# Altium schematic sheet MQ-X.SchDoc
size A
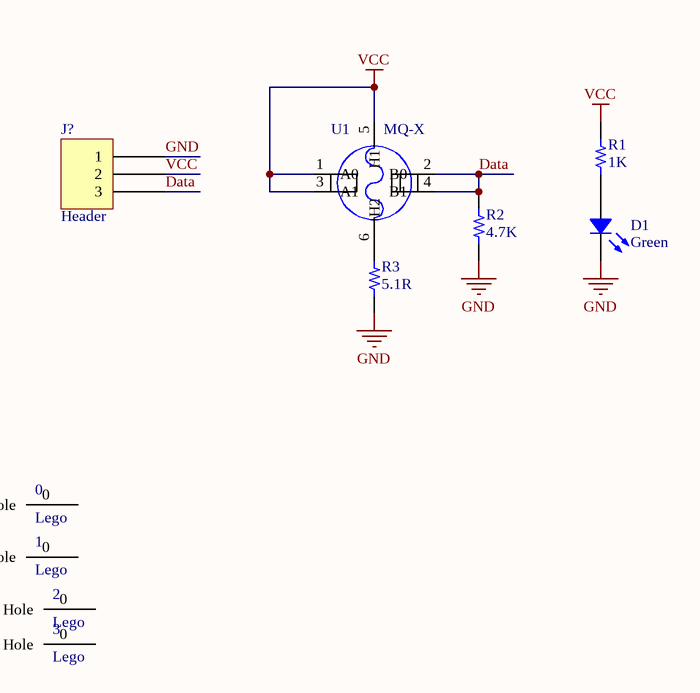
[diagram p0: MQ-X.SchDoc]

## Parts
0  Lego  [Lego Hole]
1  Lego  [Lego Hole]
2  Lego  [Lego Hole]
3  Lego  [Lego Hole]
D1  Green  [LED 1206/3216 RED]
J?  Header  [JST XH B3B-XH-A - RIGHT]
R1  1K  [RES 1206/3216]
R2  4.7K  [RES 1206/3216]
R3  5.1R  [RES 1206/3216]
U1  MQ-X  [MQ-X]

## Nets
GND: D1.2 J?.1 R2.2 R3.2
VCC: J?.2 R1.2 U1.1(A0) U1.3(A1) U1.5(H1)
Data: J?.3 R2.1 U1.2(B0) U1.4(B1)
NetD1_1: D1.1 R1.1
NetR3_1: R3.1 U1.6(H2)

Not connected (* = marked no-connect by the designer): 0 0(Lego_Hole); 1 0(Lego_Hole); 2 0(Lego_Hole); 3 0(Lego_Hole)

## Library data of the parts
D1 = LED: Chip LED; Value: Green
J? = 3 Pin
R1 = Resistor: SMT Resistor; Value: 1K
R2 R3 = Resistor: SMT Resistor; Value: 1K
U1 = MQ-X: MF: Mac8; MP: MQ9; Availability: Unavailable; Price: None; Package: None; Value: *